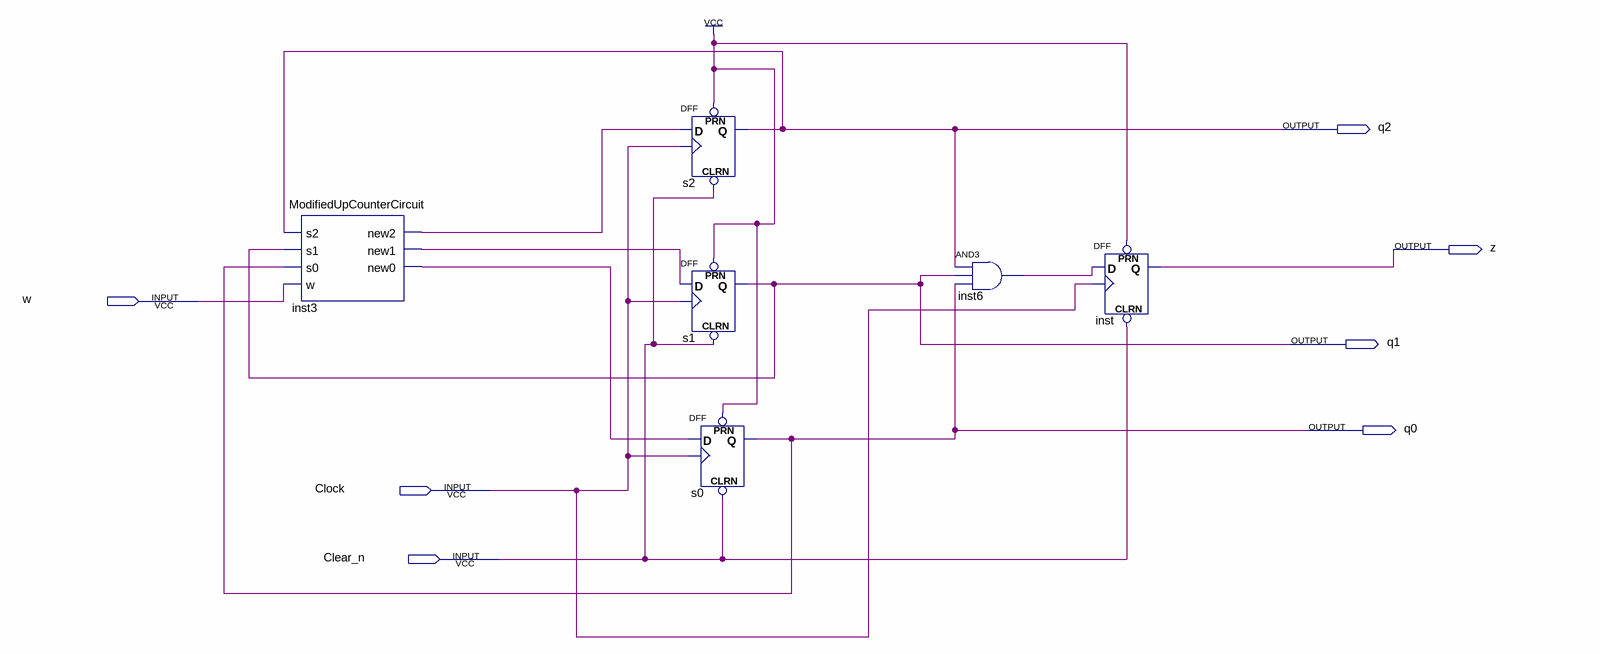
[diagram p0: schematic sheet]
// Quartus schematic ModifiedUpCounter.bdf as structural Verilog: 6 symbols, 7 pins
module ModifiedUpCounter (
  input  w,
  input  Clock,
  input  Clear_n,
  output q2,
  output z,
  output q1,
  output q0
);

  wire inst3_new0, inst3_new1, inst3_new2, inst6_out;

  ModifiedUpCounterCircuit inst3 (
    .s2(q2), .s1(q1), .s0(q0), .w(w), .new2(inst3_new2), .new1(inst3_new1), .new0(inst3_new0));
  DFF s2 (.CLRN(Clear_n), .CLK(Clock), .D(inst3_new2), .PRN(1'b1), .Q(q2));
  DFF s1 (.CLRN(Clear_n), .CLK(Clock), .D(inst3_new1), .PRN(1'b1), .Q(q1));
  DFF s0 (.CLRN(Clear_n), .CLK(Clock), .D(inst3_new0), .PRN(1'b1), .Q(q0));
  and inst6 (inst6_out, q2, q1, q0);
  DFF inst (.CLRN(Clear_n), .CLK(Clock), .D(inst6_out), .PRN(1'b1), .Q(z));
endmodule
